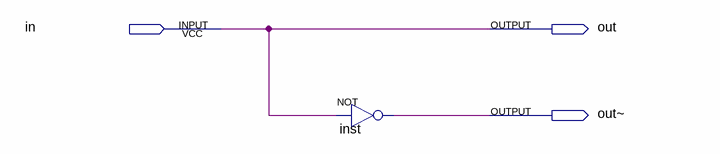
[diagram p0: schematic sheet]
// Quartus schematic X2.bdf as structural Verilog: 1 symbols, 3 pins
module X2 (
  input  in,
  output out,
  output \out~ 
);

  not inst (\out~ , in);

  assign out = in;
endmodule
